# EAGLE design Street_Fighter_v1.0 (EAGLE 7.2.0)
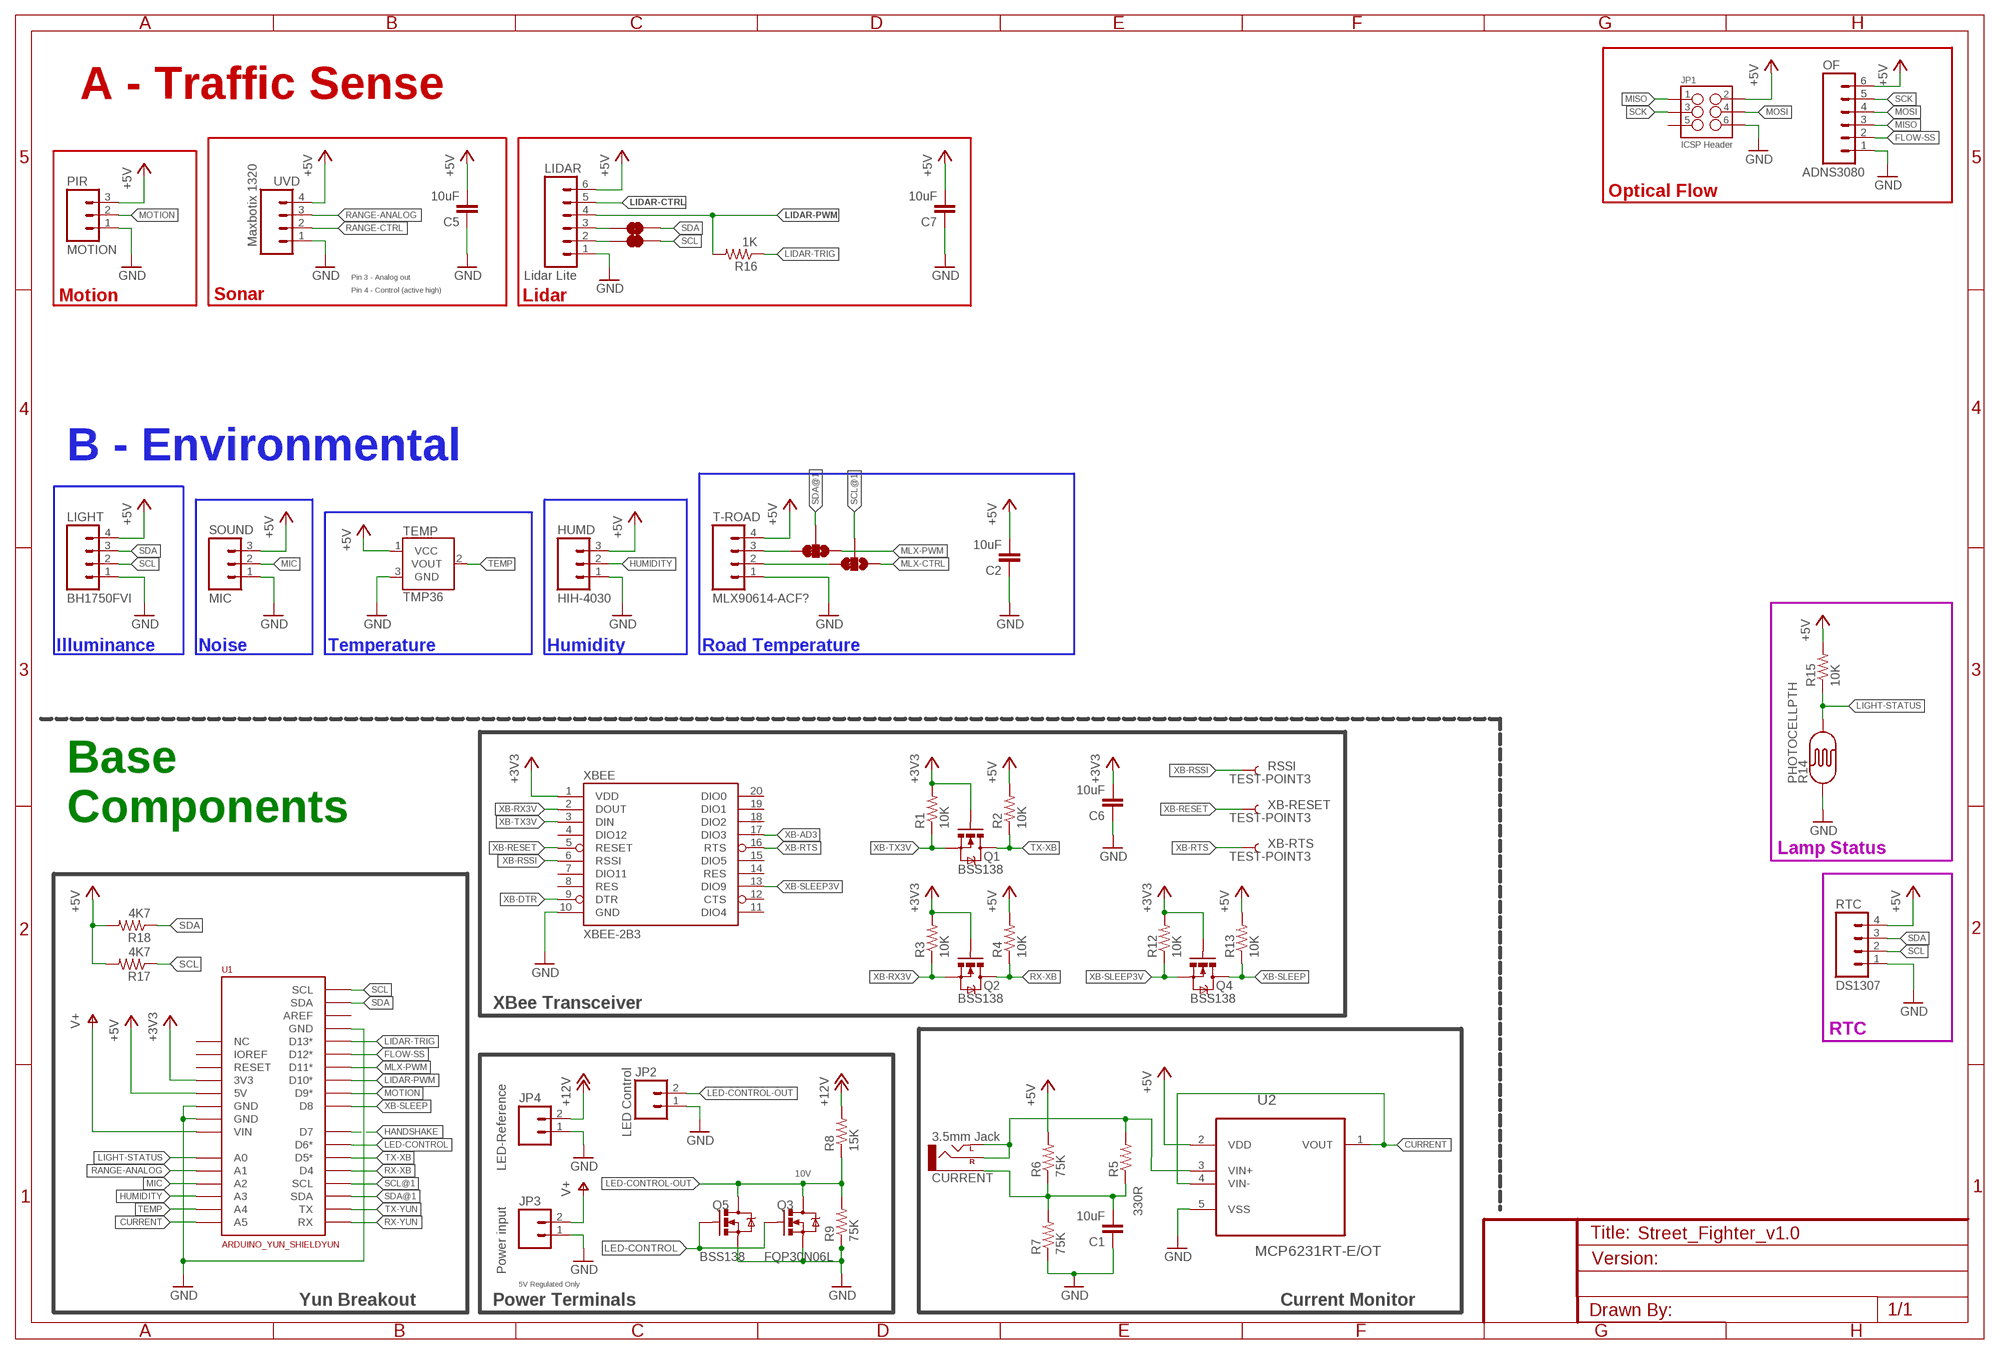
[diagram p0: schematic, sheet 1]

## Parts
C1  10uF  10UF-6.3V-20%(1206)  [1206]
C2  10uF  10UF-6.3V-20%(1206)  [1206]
C5  10uF  10UF-6.3V-20%(1206)  [1206]
C6  10uF  10UF-6.3V-20%(1206)  [1206]
C7  10uF  10UF-6.3V-20%(1206)  [1206]
CURRENT  3.5mm Jack  AUDIO-JACKPTH  [AUDIO-JACK]
HUMD  HIH-4030  M03PTH  [1X03]
JP1  ICSP Header  M03X22X3_SILK_SM  [2X3]
JP2  LED Control  M02PTH3  [1X02_LONGPADS]
JP3  Power input  M02PTH3  [1X02_LONGPADS]
JP4  LED-Reference  M02PTH3  [1X02_LONGPADS]
LIDAR  Lidar Lite  M06SIP  [1X06]
LIGHT  BH1750FVI  M04PTH  [1X04]
OF  ADNS3080  M06SIP  [1X06]
PIR  MOTION  M03PTH  [1X03]
Q1  BSS138  MOSFET-NCHANNELBSS123LT1G  [SOT23]
Q2  BSS138  MOSFET-NCHANNELBSS123LT1G  [SOT23]
Q3  FQP30N06L  MOSFET-NCHANNELFQP30N06L  [TO220V]
Q4  BSS138  MOSFET-NCHANNELBSS123LT1G  [SOT23]
Q5  BSS138  MOSFET-NCHANNELBSS123LT1G  [SOT23]
R1  10K  RESISTOR1206  [1206]
R2  10K  RESISTOR1206  [1206]
R3  10K  RESISTOR1206  [1206]
R4  10K  RESISTOR1206  [1206]
R5  330R  RESISTOR1206  [1206]
R6  75K  RESISTOR1206  [1206]
R7  75K  RESISTOR1206  [1206]
R8  15K  RESISTOR1206  [1206]
R9  75K  RESISTOR1206  [1206]
R12  10K  RESISTOR1206  [1206]
R13  10K  RESISTOR1206  [1206]
R14  PHOTOCELLPTH  [PHOTOCELL]
R15  10K  RESISTOR1206  [1206]
R16  1K  RESISTOR1206  [1206]
R17  4K7  RESISTOR1206  [1206]
R18  4K7  RESISTOR1206  [1206]
RSSI  TEST-POINT3  [PAD.03X.03]
RTC  DS1307  M04PTH  [1X04]
SJ1  JUMPER-PAD-2-NC_BY_TRACE  [PAD-JUMPER-2-NC_BY_TRACE_YES_SILK]
SJ2  JUMPER-PAD-2-NC_BY_TRACE  [PAD-JUMPER-2-NC_BY_TRACE_YES_SILK]
SJ3  JUMPER-PAD-3-2OF3_NC_BY_TRACE_SMALL  [PAD-JUMPER-3-2OF3_NC_BY_TRACE_YES_SILK_FULL_BOX]
SJ4  JUMPER-PAD-3-2OF3_NC_BY_TRACE_SMALL  [PAD-JUMPER-3-2OF3_NC_BY_TRACE_YES_SILK_FULL_BOX]
SOUND  MIC  M03PTH  [1X03]
T-ROAD  MLX90614-ACF?  M04PTH  [1X04]
TEMP  TMP36  TMP36GT9  [TO-92]
U1  ARDUINO_YUN_SHIELDYUN  [DUEMILANOVE_VIAS]
U2  MCP6231RT-E/OT  [SOT95P270X145-5N]
UVD  Maxbotix 1320  M04PTH  [1X04]
XB-RESET  TEST-POINT3  [PAD.03X.03]
XB-RTS  TEST-POINT3  [PAD.03X.03]
XBEE  XBEE-2B3  [XBEE-SMD]

## Nets
+3V3: C6.2 Q1.1(G) Q2.1(G) Q4.1(G) R1.2 R3.2 R12.2 U1.3V3 XBEE.1(VDD)
+5V: C2.2 C5.2 C7.2 HUMD.3 JP1.2 LIDAR.6 LIGHT.4 OF.6 PIR.3 R2.2 R4.2 R6.2 R13.2 R15.2 R17.2 R18.2 RTC.4 SOUND.3 T-ROAD.4 TEMP.1(VCC) U1.5V U2.2(VDD) UVD.4
+12V: JP4.2 R8.2
CURRENT: U1.A5 U2.1(VOUT) U2.4(VIN-)
FLOW-SS: OF.2 U1.12(D12*)
GND: C1.1 C2.1 C5.1 C6.1 C7.1 HUMD.1 JP1.6 JP2.1 JP3.1 JP4.1 LIDAR.1 LIGHT.1 OF.1 PIR.1 Q3.3(S) Q5.2(S) R7.1 R9.1 R14.1 RTC.1 SOUND.1 T-ROAD.1 TEMP.3(GND) U1.GND U1.GND@0(GND) U1.GND@1(GND) U2.5(VSS) UVD.1 XBEE.10(GND)
HANDSHAKE: U1.7(D7)
HUMIDITY: HUMD.2 U1.A3
LED-CONTROL: Q3.1(G) Q5.1(G) U1.6(D6*)
LED-CONTROL-OUT: JP2.2 Q3.2(D) Q5.3(D) R8.1 R9.2
LIDAR-CTRL: LIDAR.5
LIDAR-PWM: LIDAR.4 R16.2 U1.10(D10*)
LIDAR-TRIG: R16.1 U1.13(D13*)
LIGHT-STATUS: R14.2 R15.1 U1.A0
MIC: SOUND.2 U1.A2
MISO: JP1.1 OF.3
MLX-CTRL: SJ4.1
MLX-PWM: SJ3.1 U1.11(D11*)
MOSI: JP1.4 OF.4
MOTION: PIR.2 U1.9(D9*)
N$2: CURRENT.RING(RIGHT) CURRENT.TIP(LEFT) R5.2 U2.3(VIN+)
N$4: C1.2 CURRENT.SLEEVE R5.1 R6.1 R7.2
RANGE-ANALOG: U1.A1 UVD.3
RANGE-CTRL: UVD.2
RX-XB: Q2.3(D) R4.1 U1.D4
RX-YUN: U1.0(RX)
SCK: JP1.3 OF.5
SCL: LIDAR.2 LIGHT.2 R17.1 RTC.2 SJ2.1 SJ2.2 U1.3@1(SCL)
SCL@1: SJ4.2 SJ4.3 T-ROAD.2 U1.3(SCL)
SDA: LIDAR.3 LIGHT.3 R18.1 RTC.3 SJ1.1 SJ1.2 U1.2@1(SDA)
SDA@1: SJ3.2 SJ3.3 T-ROAD.3 U1.2(SDA)
TEMP: TEMP.2(VOUT) U1.A4
TX-XB: Q1.3(D) R2.1 U1.5(D5*)
TX-YUN: U1.1(TX)
V+: JP3.2 U1.VIN
XB-AD3: XBEE.17(DIO3)
XB-DTR: XBEE.9(DTR)
XB-RESET: XB-RESET.P$1 XBEE.5(RESET)
XB-RSSI: RSSI.P$1 XBEE.6(RSSI)
XB-RTS: XB-RTS.P$1 XBEE.16(RTS)
XB-RX3V: Q2.2(S) R3.1 XBEE.2(DOUT)
XB-SLEEP: Q4.3(D) R13.1 U1.8(D8)
XB-SLEEP3V: Q4.2(S) R12.1 XBEE.13(DIO9)
XB-TX3V: Q1.2(S) R1.1 XBEE.3(DIN)
Unconnected: JP1.5 U1.AREF U1.IOREF U1.NC U1.RESET XBEE.4(DIO12) XBEE.7(DIO11) XBEE.8(RES) XBEE.11(DIO4) XBEE.12(CTS) XBEE.14(RES) XBEE.15(DIO5) XBEE.18(DIO2) XBEE.19(DIO1) XBEE.20(DIO0)

## Notes on the sheet
- A - Traffic Sense
- Optical Flow
- Pin 3 - Analog out
- Pin 4 - Control (active high)
- Motion | Sonar | Lidar
- B - Environmental
- Illuminance | Noise | Temperature | Humidity | Road Temperature
- Base 
  Components
- Lamp Status
- XBee Transceiver
- RTC
- 10V
- 5V Regulated Only
- Yun Breakout | Power Terminals | Current Monitor

## Library data of the parts
C1 C2 C5-C7 = SparkFun-Capacitors:10UF-6.3V-20%(1206): Ceramic CAP-10057; PROD_ID: CAP-10057
CURRENT = SparkFun-Connectors:AUDIO-JACK: 3.5mm Audio Jack Simple 3.5mm common PCB mount audio jack. SKU: PRT-08032
HUMD PIR SOUND = SparkFun-Connectors:M03: Header 3 Standard 3-pin 0.1" header. Use with straight break away headers (SKU : PRT-00116), right angle break away headers (PRT-00553), swiss pins (PRT-00743), machine pins (PRT-00117), and female headers (PRT-00115). Molex polarized connector foot print use with SKU : PRT-08232 with associated crimp pins and housings.
JP1 = SparkFun-Connectors:M03X2: 2x3 .1" header. Shrouded, with keying- CONN-10681 SMT- CONN-11415 Pogo pins- HW-11044
JP2-JP4 = SparkFun-Connectors:M02: Header 2 Standard 2-pin 0.1" header. Use with straight break away headers (SKU : PRT-00116), right angle break away headers (PRT-00553), swiss pins (PRT-00743), machine pins (PRT-00117), and female headers (PRT-00115). Molex polarized connector foot print use with SKU : PRT-08233 with associated crimp pins and housings.
LIDAR OF = SparkFun-Connectors:M06: Header 6 Standard 6-pin 0.1" header. Use with straight break away headers (SKU : PRT-00116), right angle break away headers (PRT-00553), swiss pins (PRT-00743), machine pins (PRT-00117), and female headers (PRT-00115). Molex polarized connector foot print use with SKU : PRT-08094 with associated crimp pins and housings. NOTES ON THE VARIANTS LOCK and LOCK_LONGPADS... This footprint was designed to help hold the alignment of a through-hole component (i.e. 6-pin header) while soldering it into place. You may notice that each hole has been shifted either up or down by 0.005 of an inch from it's more standard position (which is a perfectly straight line). This slight alteration caused the pins (the squares in the middle) to touch the edges of the holes. Because they are alternating, it causes a "brace" to hold the component in place. 0.005 has proven to be the perfect amount of "off-center" position when using our standard breakaway headers. Although looks a little odd when you look at the bare footprint, once you have a header in there, the alteration is very hard to notice. Also, if you push a header all the way into place, it is covered up entirely on the bottom side. This idea of altering the position of holes to aid alignment will be further integrated into the Sparkfun Library for other footprints. It can help hold any component with 3 or more connection pins.
LIGHT RTC T-ROAD UVD = SparkFun-Connectors:M04: Header 4 Standard 4-pin 0.1" header. Use with straight break away headers (SKU : PRT-00116), right angle break away headers (PRT-00553), swiss pins (PRT-00743), machine pins (PRT-00117), and female headers (PRT-00115). Molex polarized connector foot print use with SKU : PRT-08231 with associated crimp pins and housings. 1MM SMD Version SKU: PRT-10208
Q1 Q2 Q4 Q5 = SparkFun-DiscreteSemi:MOSFET-NCHANNEL: Common NMOSFET Parts MFG P/N Store ID Prod ID FDD8780 TRANS-09984 SI7820DN TRANS-11055 FDS6630A IC-08089 2N7002PW TRANS-11151 FQP30N06L COM-10213 TRANS-10060 BSS123LT1G TRANS-08345 BSS138 TRANS-00830 BS170 2N7000; PROD_ID: TRANS-08345
Q3 = SparkFun-DiscreteSemi:MOSFET-NCHANNEL: Common NMOSFET Parts MFG P/N Store ID Prod ID FDD8780 TRANS-09984 SI7820DN TRANS-11055 FDS6630A IC-08089 2N7002PW TRANS-11151 FQP30N06L COM-10213 TRANS-10060 BSS123LT1G TRANS-08345 BSS138 TRANS-00830 BS170 2N7000; PROD_ID: TRANS-10060
R1-R9 R12 R13 R15-R18 = SparkFun-Passives:RESISTOR: Resistor Basic schematic elements and footprints for 0603, 1206, and PTH resistors.
R14 = SparkFun-Sensors:PHOTOCELL: CdS photoresistor. This is a low cost way to detect light levels. Resistance decreases with more incoming light. SparkFun SKU: SEN-09088
RSSI XB-RESET XB-RTS = SparkFun-Passives:TEST-POINT: Bare copper test points for troubleshooting or ICT
SJ1 SJ2 = SparkFun-Passives:JUMPER-PAD-2-NC_BY_TRACE
SJ3 SJ4 = SparkFun-Passives:JUMPER-PAD-3-2OF3_NC_BY_TRACE
TEMP = SparkFun-Sensors:TMP36: Precision degC temp sensor, analog out
U1 = SparkFun-Boards:ARDUINO_YUN_SHIELD
U2 = Microchip_By_element14_Batch_1:MCP6231RT-E/OT: 20 µA, 300 kHz Rail-to-Rail Op Amp; DESCRIPTION: OP AMP; MPN: MCP6231RT-E/OT; OC_FARNELL: 1840878; OC_NEWARK: 84R5186; PACKAGE: SOT-5; SUPPLIER: Microchip
XBEE = SparkFun-RF:XBEE-2: Xbee module footprints SMT header is CONN-09042.; PROD_ID: CONN-09042

## Board
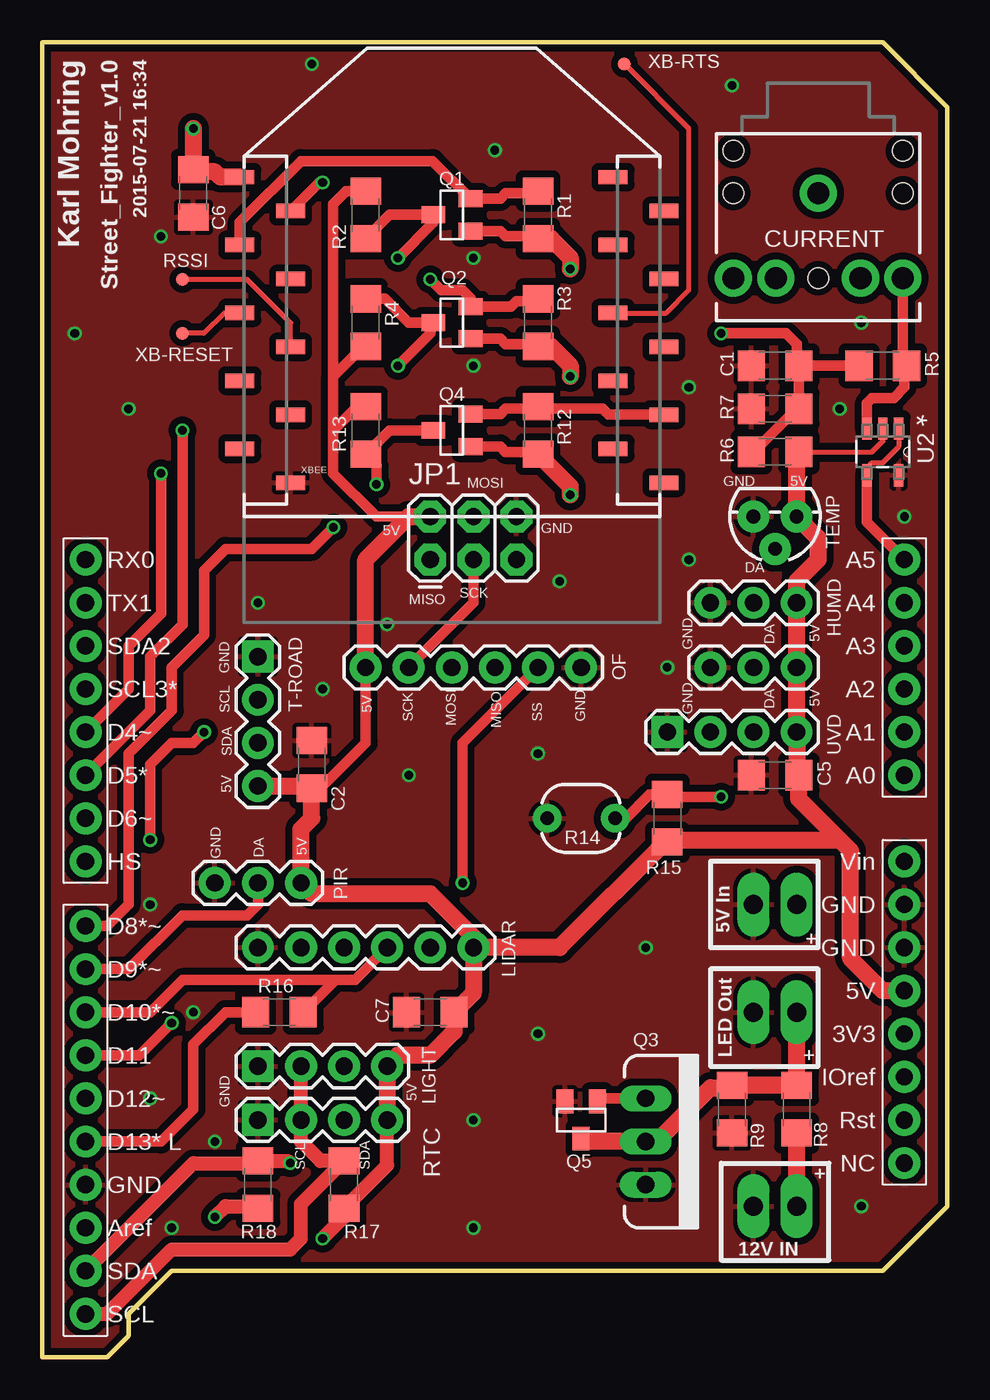
[diagram p1: board, top side]
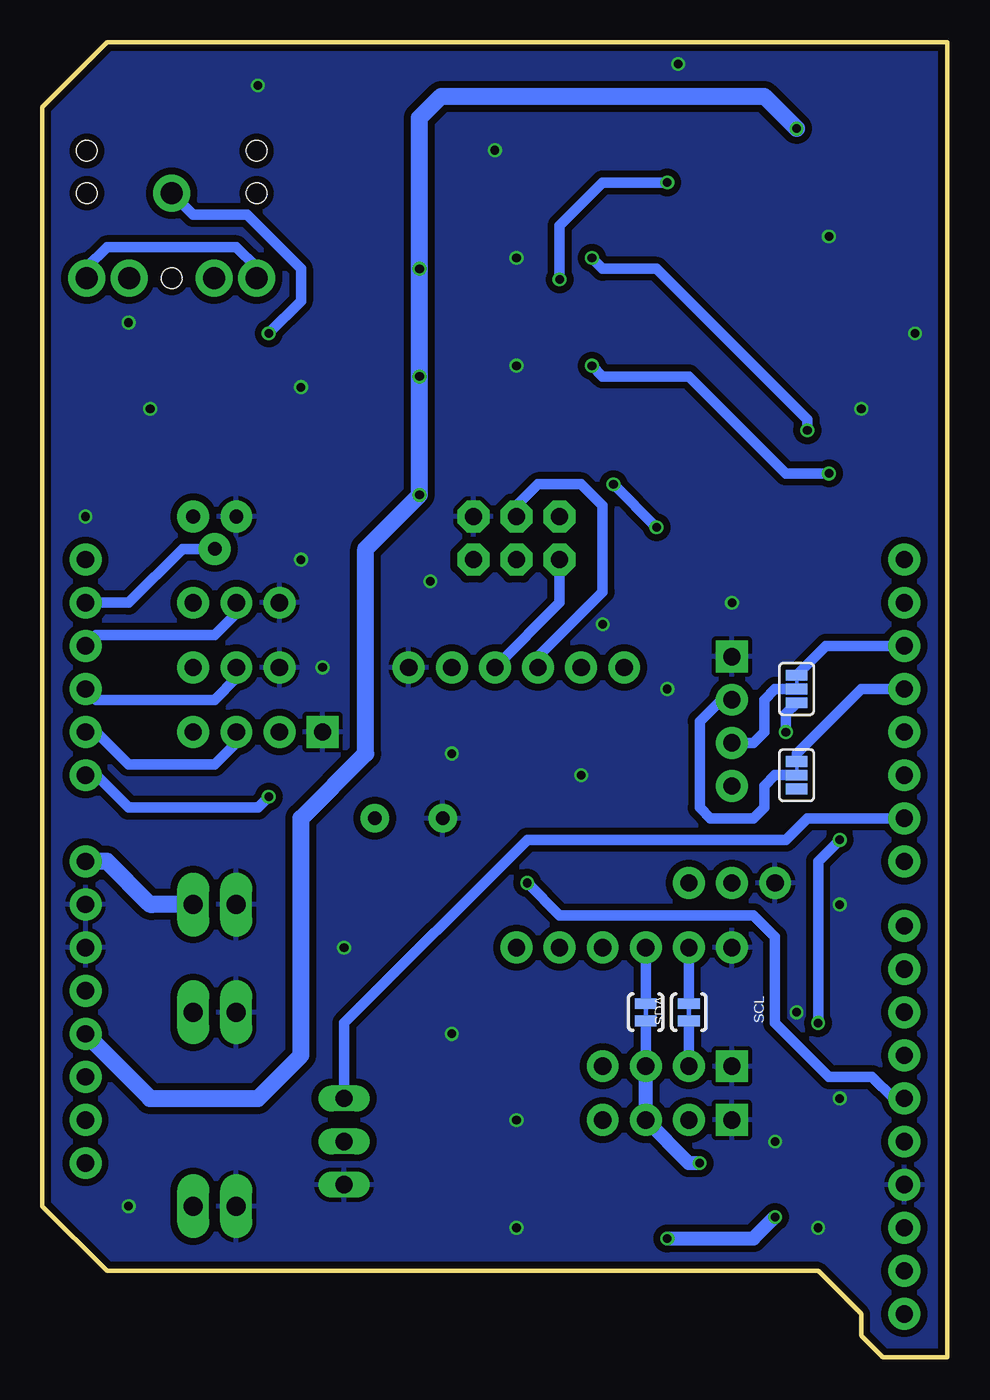
[diagram p2: board, bottom side, seen from below]

Size 53.34 x 77.47 mm. Coordinates in mm from the lower left corner, seen from the top.
Outline: 0,66.04 0,0
Outline: 0,0 3.81,0 5.08,1.27 5.08,2.54 7.62,5.08 49.53,5.08 53.34,8.89 53.34,73.66 49.53,77.47 0,77.47 0,0
Copper layers (1*16): Top 0.035mm / dielectric 1.5mm / Bottom 0.035mm
Design rules "ITEADstudio_DRC": minimum track width 6mil, minimum drill 12mil, track to track 6mil, track to pad 6mil, pad to pad 6mil, via to via 6mil, smd to smd 0mil, copper to edge 10mil, drill to drill 10mil, minimum pad ring 10mil, minimum via ring 6mil, stop-mask expansion 2mil, vias tented up to drill 100mil, thermal gap 10mil

### Footprints (pad centres in the part's own frame; a part is rotated, then mirrored left to right if it is on the bottom)
1206 = smd 1.6 x 1.8: 1 -1.4,0; 2 1.4,0
AUDIO-JACK = drill 1.3 pad 2.184: RING 5,5; RSH 5,2.5; SLEEVE 0,0; TIP 5,-5; TSH 5,-2.5 | hole 1.2: 0,5; -2.5,5; -2.5,-5; 0,-5; 5,0
1X03 = drill 1.016 pad 1.88: 1 0,0; 2 2.54,0; 3 5.08,0
2X3 = drill 1.016 pad 1.88 octagon: 1 0,0; 2 0,2.54; 3 2.54,0; 4 2.54,2.54; 5 5.08,0; 6 5.08,2.54
1X02_LONGPADS = drill 1.118 pad 1.88 long: 1 0,0; 2 2.54,0
1X06 = drill 1.016 pad 1.88: 1 0,0; 2 2.54,0; 3 5.08,0; 4 7.62,0; 5 10.16,0; 6 12.7,0
1X04 = drill 1.016 pad 1.88 square: 1 0,0 | drill 1.016 pad 1.88: 2 2.54,0; 3 5.08,0; 4 7.62,0
SOT23 = smd 1 x 1.4: 1 -0.95,-1.1; 2 0.95,-1.1; 3 0,1.1
TO220V = drill 1.016 long: 1 -2.54,0; 2 0,0; 3 2.54,0
PHOTOCELL = drill 0.8 pad 1.676: 1 -2,0; 2 2,0
PAD.03X.03 = smd 0.762 x 0.762: P$1 0,0
PAD-JUMPER-2-NC_BY_TRACE_YES_SILK = smd 0.635 x 1.27: 1 -0.508,0; 2 0.508,0
PAD-JUMPER-3-2OF3_NC_BY_TRACE_YES_SILK_FULL_BOX = smd 0.635 x 1.27: 1 -0.813,0; 2 0,0; 3 0.813,0
TO-92 = drill 0.813 pad 1.88: 1 -1.27,0; 2 0,1.905; 3 1.27,0
DUEMILANOVE_VIAS = drill 1.016 pad 1.88: 0 2.54,41.91; 1 2.54,39.37; 2 2.54,36.83; 2@1 2.54,0; 3 2.54,34.29; 3@1 2.54,-2.54; 3V3 50.8,13.97; 5 2.54,29.21; 5V 50.8,16.51; 6 2.54,26.67; 7 2.54,24.13; 8 2.54,20.32; 9 2.54,17.78; 10 2.54,15.24; 11 2.54,12.7; 12 2.54,10.16; 13 2.54,7.62; A0 50.8,29.21; A1 50.8,31.75; A2 50.8,34.29; A3 50.8,36.83; A4 50.8,39.37; A5 50.8,41.91; AREF 2.54,2.54; D4 2.54,31.75; GND 2.54,5.08; GND@0 50.8,19.05; GND@1 50.8,21.59; IOREF 50.8,11.43; NC 50.8,6.35; RESET 50.8,8.89; VIN 50.8,24.13
SOT95P270X145-5N = smd 1.321 x 0.559: 1 -1.372,0.94; 2 -1.372,0; 3 -1.372,-0.94; 4 1.372,-0.94; 5 1.372,0.94
XBEE-SMD = smd 1.7 x 0.85: 1 -12.5,20; 2 -9.5,18; 3 -12.5,16; 4 -9.5,14; 5 -12.5,12; 6 -9.5,10; 7 -12.5,8; 8 -9.5,6; 9 -12.5,4; 10 -9.5,2; 11 12.5,2; 12 9.5,4; 13 12.5,6; 14 9.5,8; 15 12.5,10; 16 9.5,12; 17 12.5,14; 18 9.5,16; 19 12.5,18; 20 9.5,20

### Placement (x,y rotation side)
C1  43.18,58.42 0 top
C2  15.88,34.92 270 top
C5  43.18,34.29 0 top
C6  8.89,68.58 90 top
C7  22.86,20.32 0 top
CURRENT  45.72,68.58 270 top
HUMD  39.37,44.45 0 top
JP1  22.86,46.99 0 top
JP2  41.91,20.32 0 top
JP3  41.91,26.67 0 top
JP4  41.91,8.89 0 top
LIDAR  12.7,24.13 0 top
LIGHT  12.7,17.14 0 top
OF  31.75,40.64 180 top
PIR  10.16,27.94 0 top
Q1  24.13,67.31 90 top
Q2  24.13,60.96 90 top
Q3  35.56,12.7 270 top
Q4  24.13,54.61 90 top
Q5  31.75,13.97 180 top
R1  29.21,67.31 270 top
R2  19.05,67.31 90 top
R3  29.21,60.96 270 top
R4  19.05,60.96 270 top
R5  49.53,58.42 0 top
R6  43.18,53.34 0 top
R7  43.18,55.88 0 top
R8  44.45,14.61 270 top
R9  40.64,14.61 90 top
R12  29.21,54.61 270 top
R13  19.05,54.61 90 top
R14  31.75,31.75 0 top
R15  36.83,31.75 270 top
R16  13.97,20.32 0 top
R17  17.78,10.16 270 top
R18  12.7,10.16 270 top
RSSI  8.26,63.5 0 top
RTC  12.7,13.97 0 top
SJ1  17.78,20.32 90 bottom
SJ2  15.24,20.32 270 bottom
SJ3  8.89,39.37 90 bottom
SJ4  8.89,34.29 90 bottom
SOUND  39.37,40.64 0 top
T-ROAD  12.7,41.27 270 top
TEMP  43.18,49.53 180 top
U1  0,5.08 0 top
U2  49.53,53.34 270 top
UVD  36.83,36.83 0 top
XB-RESET  8.26,60.33 0 top
XB-RTS  34.29,76.2 0 top
XBEE  24.13,49.53 0 top

### Tracks (layer width: path | path; a pad name or v marks a point on that pad's centre or on a via)
+3V3  (via drill 0.51)
  Top 0.61: Q4.1 26.98,53.66 27.3,53.34 29.08,53.34 R12.2 | Q2.1 26.98,60.01 27.3,59.69 29.08,59.69 R3.2 | Q1.1 26.98,66.36 27.3,66.04 29.08,66.04 R1.2
  Top 1.016: v8.89,72.39 C6.2 9.02,69.85 10.16,69.85 10.48,69.53 XBEE.1 | v31.11,50.8 31.11,51.3 R12.2 | R3.2 29.98,59.56 31.11,58.42 v31.11,57.78 | R1.2 29.98,65.91 31.11,64.77 v31.11,64.14
  Bottom 1.016: v8.89,72.39 10.79,74.3 29.84,74.3 31.11,73.03 v31.11,64.14 v31.11,57.78 v31.11,50.8 34.29,47.62 34.29,35.56 38.1,31.75 38.1,17.78 40.64,15.24 46.99,15.24 U1.3V3
+5V  (via drill 0.51)
  Top 0.305: R6.2 48.9,53.34 49.53,53.98 U2.2
  Top 0.61: JP1.2 19.68,49.53 17.14,52.07 17.14,54.61 | 17.14,54.61 17.14,57.78 | 18.92,55.88 R13.2 18.55,56.01 17.14,54.61 | R2.2 17.91,68.71 17.14,67.94 17.14,57.78 | R4.2 18.92,59.56 17.14,57.78 | 15.74,33.66 16.51,33.66 19.05,36.2 OF.6
  Top 0.813: v10.16,8.26 10.79,8.89 12.57,8.89 R18.2 | v16.51,6.99 17.78,8.26 R17.2 20.32,11.3 RTC.4
  Top 1.016: U1.5V 49.63,21.59 arc-45 49.46,21.66 47.62,23.5 47.62,29.74 arc45 47.55,29.92 46.99,30.48 | 46.99,30.48 44.58,32.89 C5.2 44.52,34.35 arc-45 44.45,34.52 UVD.4 SOUND.3 HUMD.3 44.45,45.62 arc-45 44.52,45.79 45.72,46.99 45.72,48.16 arc45 45.65,48.33 TEMP.1 44.45,53.1 arc-45 44.52,53.28 R6.2 | R15.2 36.96,30.48 | 36.96,30.48 46.99,30.48 | 36.96,30.48 36.83,30.48 30.48,24.13 LIDAR.6 | RTC.4 LIGHT.4 20.95,17.78 22.86,17.78 24.26,19.18 C7.2 25.4,21.46 LIDAR.6 | T-ROAD.4 15.74,33.66 C2.2 15.88,31.75 15.24,31.11 PIR.3 15.88,27.3 22.86,27.3 25.4,24.77 LIDAR.6 | OF.6 19.05,46.99 21.59,49.53 JP1.2
  Bottom 0.813: v16.51,6.99 11.43,6.99 v10.16,8.26
+12V
  Top 1.016: JP4.2 R8.2
CURRENT
  Top 0.305: U2.4 48.59,52.3 arc-45 48.66,52.48 48.9,52.7 49.53,52.7 50.47,53.65 U2.1
  Top 0.61: U2.4 48.59,49.2 U1.A5
FLOW-SS  (via drill 0.51)
  Top 0.61: v24.77,27.94 24.77,36.2 OF.2
  Bottom 0.61: U1.12 3.17,15.24 4.45,16.51 6.99,16.51 10.16,19.68 10.16,24.77 11.43,26.04 22.86,26.04 v24.77,27.94
GND  (via drill 0.51)
  other vias: 25.4,58.42 25.4,64.77 46.99,55.88 48.26,60.96 5.08,55.88 1.91,60.33 25.4,13.97 25.4,7.62 7.62,7.62 6.35,15.24 6.35,26.67 8.89,20.32 29.21,19.05 35.56,24.13 21.59,34.29 29.21,35.56 6.99,66.04 15.88,76.2 26.67,71.12 40.64,74.93 38.1,57.15 38.1,46.99 30.48,45.72 48.26,8.89 36.83,40.64 16.51,39.37 12.7,44.45 10.16,12.7 50.8,49.53 20.32,43.18
  pour Top (isolate 0.406): 0,0 0,77.47 49.53,77.47 53.34,73.66 53.34,8.89 49.53,5.08 7.62,5.08 5.08,2.54 5.08,1.27 5.08,0
  pour Bottom (isolate 0.406): 0,0 0,77.47 49.53,77.47 53.34,73.66 53.34,8.89 49.53,5.08 7.62,5.08 6.35,3.81 6.35,0
HUMIDITY
  Bottom 0.61: HUMD.2 41.91,43.81 43.18,42.55 50.16,42.55 U1.A3
LED-CONTROL
  Top 0.61: Q3.1 32.87,15.24 Q5.1
  Bottom 0.61: U1.6 8.26,31.75 9.53,30.48 24.77,30.48 35.56,19.68 Q3.1
LED-CONTROL-OUT
  Top 1.016: JP2.2 R8.1 R9.2 40.58,15.95 arc-45 40.41,15.88 39.37,15.88 36.27,12.77 arc-45 36.09,12.7 Q3.2 32.02,12.7 arc-45 31.85,12.77 Q5.3
LIDAR-PWM
  Top 0.61: 17.27,22.23 8.26,22.23 6.35,20.32 U1.10 | LIDAR.4 18.41,22.23 17.27,22.23 | 17.27,22.23 R16.2
LIDAR-TRIG
  Top 0.61: R16.1 10.79,20.32 8.89,18.41 8.89,14.61 6.99,12.7 U1.13
LIGHT-STATUS  (via drill 0.51)
  Top 0.61: v40.01,33.02 36.96,33.02 R15.1 35.78,33.15 34.38,31.75 R14.2
  Bottom 0.61: U1.A0 50.16,34.29 48.26,32.38 40.64,32.38 v40.01,33.02
MIC
  Bottom 0.61: SOUND.2 41.91,40.01 43.18,38.73 50.16,38.73 U1.A2
MISO
  Bottom 0.61: OF.3 22.86,44.45 JP1.1
MLX-PWM  (via drill 0.51)
  Top 0.61: U1.11 5.71,17.78 v7.62,19.68 | v6.35,30.48 6.35,34.92 7.62,36.2 8.89,36.2 v9.53,36.83
  Bottom 0.61: v7.62,19.68 7.62,29.21 v6.35,30.48 | v9.53,36.83 9.53,37.92 SJ3.1
MOSI
  Bottom 0.61: OF.4 24.13,41.27 20.32,45.09 20.32,50.16 21.59,51.44 24.13,51.44 25.4,50.16 JP1.4
MOTION
  Top 0.61: U1.9 5.08,22.86 8.26,26.04 12.06,26.04 12.7,26.67 PIR.2
N$2
  Top 0.61: U2.3 48.59,56.21 48.9,56.52 50.16,56.52 50.8,57.15 50.8,58.29 R5.2 50.72,58.63 CURRENT.RING
  Bottom 0.61: CURRENT.RING 50.72,64.22 49.53,65.41 41.91,65.41 40.72,64.22 CURRENT.TIP
N$4  (via drill 0.51)
  Top 0.61: C1.2 R7.2 44.45,55.88 41.91,53.34 R6.1 | C1.2 R5.1 | C1.2 44.45,58.55 44.45,59.69 43.81,60.33 v40.01,60.33
  Bottom 0.61: CURRENT.SLEEVE 44.45,67.31 41.27,67.31 38.1,64.14 38.1,62.23 v40.01,60.33
RANGE-ANALOG
  Bottom 0.61: UVD.3 41.91,36.2 43.18,34.92 48.26,34.92 50.16,36.83 U1.A1
RX-XB  (via drill 0.51)
  Top 0.61: v20.95,58.42 22.86,60.33 22.86,60.79 Q2.3 21.59,60.96 20.19,62.36 R4.1 | U1.D4 5.08,39.37 5.08,41.91 6.99,43.81 v6.99,52.07
  Bottom 0.61: v20.95,58.42 20.32,57.78 15.24,57.78 9.53,52.07 v6.99,52.07
SCK
  Top 0.61: OF.5 25.4,44.45 JP1.3
SCL
  Top 0.813: U1.3@1 3.81,2.54 7.62,6.35 14.61,6.35 15.24,6.99 15.24,9.02 R17.1 16.38,11.56 15.24,12.7 RTC.2 LIGHT.2
  Bottom 0.254: SJ2.2 SJ2.1
  Bottom 0.61: SJ2.1 LIDAR.2 | SJ2.2 LIGHT.2
SCL@1
  Bottom 0.305: SJ4.3 8.89,34.92
  Bottom 0.61: U1.3 5.08,39.37 8.89,35.56 SJ4.3 | T-ROAD.2 13.34,38.73 14.61,37.47 14.61,32.38 13.97,31.75 11.43,31.75 10.79,32.38 10.79,33.66 10.16,34.29 SJ4.2
SDA  (via drill 0.51)
  Top 0.813: U1.2@1 8.89,11.43 12.57,11.43 R18.1 14.47,11.56 v14.61,11.43
  Bottom 0.254: SJ1.2 SJ1.1
  Bottom 0.61: LIGHT.3 SJ1.1 | SJ1.2 LIDAR.3
  Bottom 0.813: LIGHT.3 RTC.3 15.24,11.43 v14.61,11.43
SDA@1
  Bottom 0.305: SJ3.3 8.89,40.01
  Bottom 0.61: U1.2 7.16,41.91 SJ3.3 | SJ3.2 10.16,39.37 10.79,38.73 10.79,36.83 11.43,36.2 T-ROAD.3
TEMP
  Bottom 0.61: TEMP.2 45.09,47.62 48.26,44.45 U1.A4
TX-XB  (via drill 0.51)
  Top 0.61: v20.95,64.77 23.03,66.84 Q1.3 20.45,67.31 R2.1 | v8.26,54.61 8.26,43.18 6.35,41.27 6.35,38.1 U1.5
  Bottom 0.61: v8.26,54.61 8.26,55.24 17.14,64.14 20.32,64.14 v20.95,64.77
V+
  Bottom 1.016: JP3.2 46.88,26.67 arc45 47.06,26.74 49.53,29.21 U1.VIN
XB-RESET
  Top 0.305: XBEE.5 10.73,61.53 9.53,60.33 XB-RESET.P$1
XB-RSSI
  Top 0.305: XBEE.6 14.63,60.94 12.06,63.5 RSSI.P$1
XB-RTS
  Top 0.305: XBEE.16 36.77,61.53 38.1,62.87 38.1,72.39 XB-RTS.P$1
XB-RX3V  (via drill 0.51)
  Top 0.61: R3.1 29.08,62.23 27.94,62.23 27.62,61.91 Q2.2 25.23,62.4 24.77,62.87 23.5,62.87 v22.86,63.5 | XBEE.2 16.32,69.22 v16.51,69.22
  Bottom 0.61: v16.51,69.22 20.32,69.22 22.86,66.67 v22.86,63.5
XB-SLEEP  (via drill 0.51)
  Top 0.61: Q4.3 20.45,54.61 R13.1 19.68,52.58 v19.68,51.44 | U1.8 3.81,25.4 5.08,26.67 5.08,35.56 7.62,38.1 7.62,40.64 9.53,42.55 9.53,46.35 10.79,47.62 15.88,47.62 v17.14,48.9
  Bottom 0.61: v17.14,48.9 v19.68,51.44
XB-SLEEP3V
  Top 0.61: Q4.2 26.98,55.56 27.3,55.88 29.08,55.88 R12.1 29.34,55.88 33.02,55.88 33.37,55.53 XBEE.13
XB-TX3V
  Top 0.61: R1.1 29.08,68.58 27.3,68.58 26.98,68.26 Q1.2 23,70.48 15.24,70.48 11.63,66.88 XBEE.3

### Text on the board
tNames: Karl Mohring | 2015-07-21 16:34 | XB-RTS | RSSI | XB-RESET | MOSI | GND | 5V | 5V | GND | DA | MISO | SCK | GND | DA | 5V | GND | GND | DA | 5V | SCL | 5V | SCK | MOSI | MISO | SS | GND | SDA | 5V | GND | DA | 5V | 5V In | + | LED Out | + | 5V | GND | SCL | SDA | + | 12V IN
bNames: SCL | SDA